# EAGLE schematic logic_vB (EAGLE 6.4)

## Sheet 1 of 4: Power
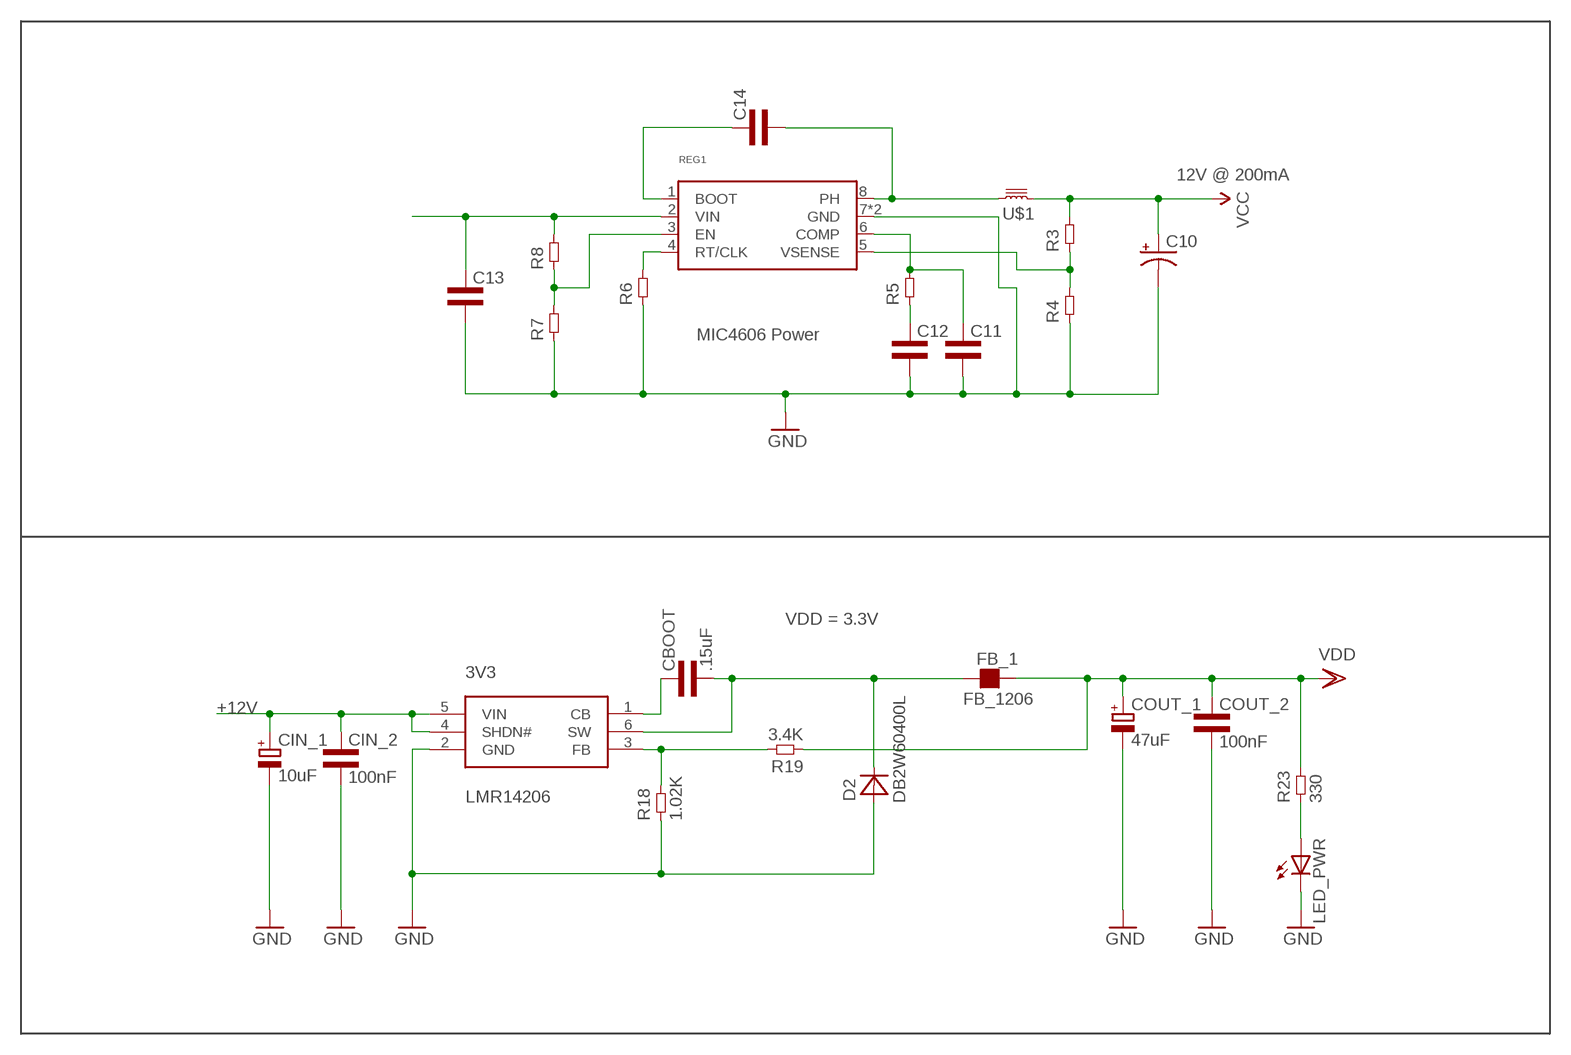
[diagram p0: schematic, sheet 1]

### Parts
3V3  LMR14206  [R-PDSO-G6]
C10  CPOL-US153CLV-0605  [153CLV-0605]
C11  CAP0603L3  [0603L3]
C12  CAP0603L3  [0603L3]
C13  CAP0805L3  [0805L3]
C14  CAP0603L3  [0603L3]
CBOOT  .15uF  CAP0603L3  [0603L3]
CIN_1  10uF  CPOL-EUB/3528-21W  [B/3528-21W]
CIN_2  100nF  CAP0603L3  [0603L3]
COUT_1  47uF  CPOL-EUB/3528-21W  [B/3528-21W]
COUT_2  100nF  CAP0603L3  [0603L3]
D2  DB2W60400L  [SC-109B]
FB_1  FB_1206  [L1206]
LED_PWR  LEDCHIP-LED0603  [CHIP-LED0603]
R3  RES0603L3  [0603L3]
R4  RES0603L3  [0603L3]
R5  RES0603L3  [0603L3]
R6  RES0603L3  [0603L3]
R7  RES0603L3  [0603L3]
R8  RES0603L3  [0603L3]
R18  1.02K  RES0402L3  [0402L3]
R19  3.4K  RES0402L3  [0402L3]
R23  330  RES0402L3  [0402L3]
REG1  TPS54061  [S-PVSON-N8]
U$1  SDR0604  [SDR0604]

### Nets
3V3: 3V3.6(SW) CBOOT.P$2 D2.1(C) FB_1.1
+12V: 3V3.4(SHDN#) 3V3.5(VIN) C13.1 CIN_1.+ CIN_2.P$1 R8.P$2 REG1.2(VIN) ; also sheet 4
BOOT: C14.P$1 REG1.1(BOOT)
COMP: C11.P$1 R5.P$2 REG1.6(COMP)
EN: R7.P$2 R8.P$1 REG1.3(EN)
GND: 3V3.2(GND) C10.- C11.P$2 C12.P$2 C13.2 CIN_1.- CIN_2.P$2 COUT_1.- COUT_2.P$2 D2.2(A) LED_PWR.C R4.P$1 R6.P$1 R7.P$1 R18.P$1 REG1.7(GND) REG1.P$1(GND) ; also sheet 2,3,4
N$9: 3V3.1(CB) CBOOT.P$1
N$20: 3V3.3(FB) R18.P$2 R19.P$2
N$33: C12.P$1 R5.P$1
N$39: LED_PWR.A R23.P$1
PH: C14.P$2 REG1.8(PH) U$1.2
RT: R6.P$2 REG1.4(RT/CLK)
VCC: C10.+ R3.P$2 U$1.1 ; also sheet 2
VDD: COUT_1.+ COUT_2.P$1 FB_1.2 R19.P$1 R23.P$2 ; also sheet 2,3
VSENSE: R3.P$1 R4.P$2 REG1.5(VSENSE)

### Notes on the sheet
- 12V @ 200mA
- MIC4606 Power
- VDD = 3.3V

## Sheet 2 of 4: MCU
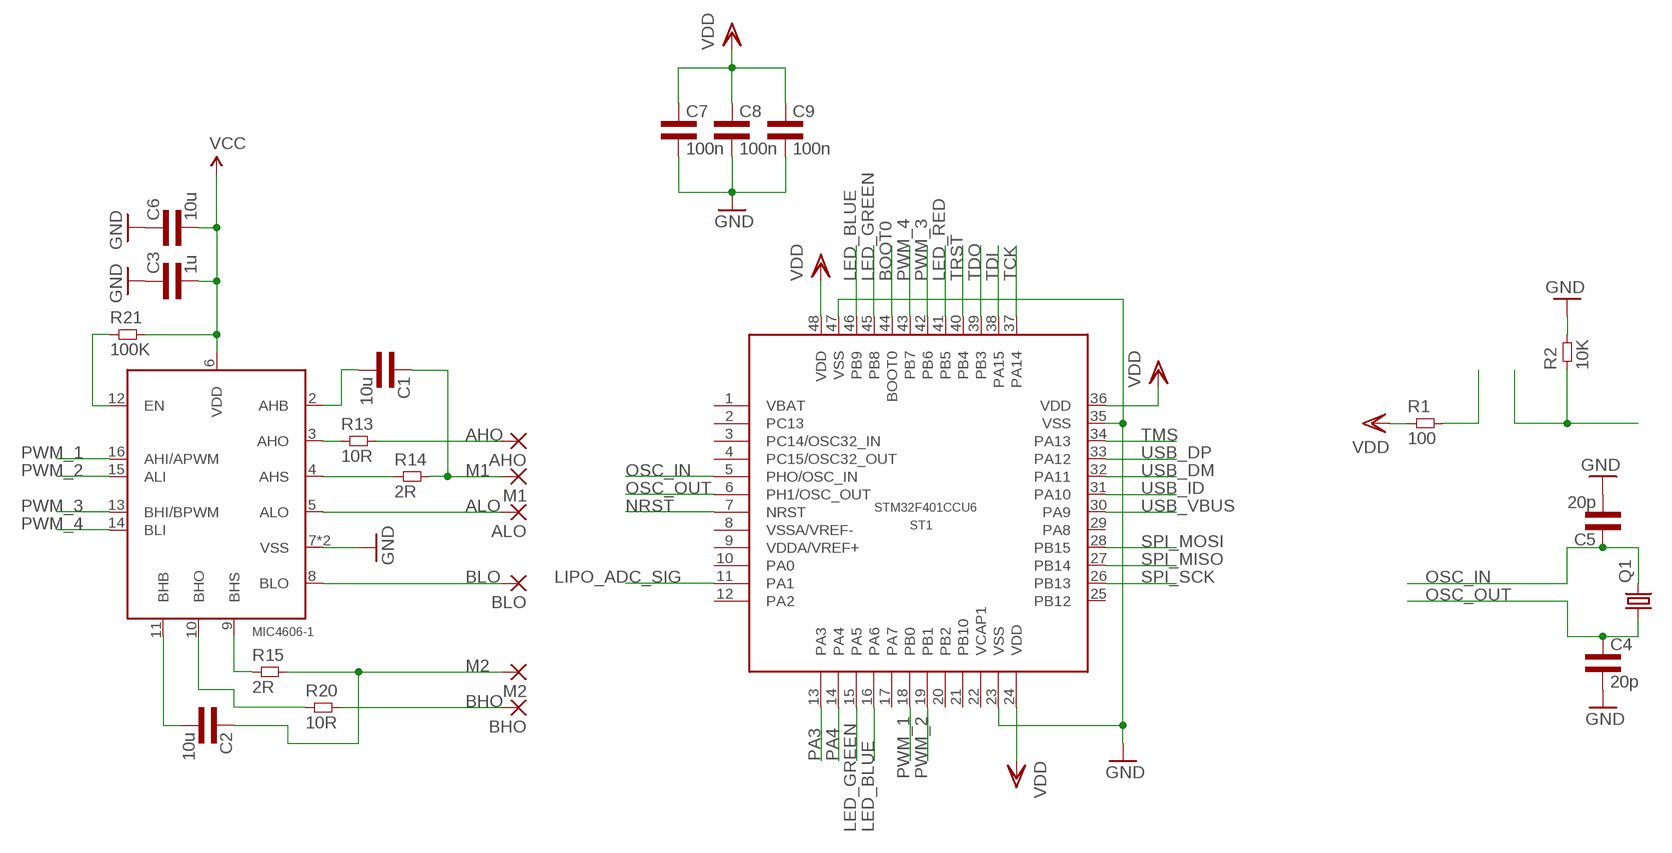
[diagram p1: schematic, sheet 2]

### Parts
AHO  2,54/1,1  [2,54/1,1]
ALO  2,54/1,1  [2,54/1,1]
BHO  2,54/1,1  [2,54/1,1]
BLO  2,54/1,1  [2,54/1,1]
C1  10u  CAP0805L3  [0805L3]
C2  10u  CAP0805L3  [0805L3]
C3  1u  CAP0603L3  [0603L3]
C4  20p  CAP0402L3  [0402L3]
C5  20p  CAP0402L3  [0402L3]
C6  10u  CAP0603L3  [0603L3]
C7  100n  CAP0402L3  [0402L3]
C8  100n  CAP0402L3  [0402L3]
C9  100n  CAP0402L3  [0402L3]
M1  2,54/1,1  [2,54/1,1]
M2  2,54/1,1  [2,54/1,1]
MD1  MIC4606-1  [QFN44-16LD-PL-2]
Q1  CRYSTALCTS406  [CTS406]
R1  100  RES0402L3  [0402L3]
R2  10K  RES0402L3  [0402L3]
R13  10R  RES0805L3  [0805L3]
R14  2R  RES0805L3  [0805L3]
R15  2R  RES0805L3  [0805L3]
R20  10R  RES0805L3  [0805L3]
R21  100K  RES0603L3  [0603L3]
ST1  STM32F401CCU6  [UFQFPN48]

### Nets
AHO: AHO.1(P) R13.2
ALO: ALO.1(P) MD1.5(ALO)
BHO: BHO.1(P) R20.2
BLO: BLO.1(P) MD1.8(BLO)
BOOT0: ST1.44(BOOT0)
GND: C3.P$1 C4.P$2 C5.P$2 C6.P$1 C7.P$2 C8.P$2 C9.P$2 MD1.7(VSS) MD1.TP(VSS) R2.P$2 ST1.23(VSS) ST1.35(VSS) ST1.47(VSS) ; also sheet 1,3,4
LED_BLUE: ST1.16(PA6) ST1.46(PB9) ; also sheet 3
LED_GREEN: ST1.15(PA5) ST1.45(PB8) ; also sheet 3
LED_RED: ST1.41(PB5) ; also sheet 3
LIPO_ADC_SIG: ST1.11(PA1) ; also sheet 4
M1: C1.1 M1.1(P) R14.2
M2: C2.1 M2.1(P) R15.2
N$3: C1.2 MD1.2(AHB)
N$4: C2.2 MD1.11(BHB)
N$7: MD1.3(AHO) R13.1
N$14: MD1.4(AHS) R14.1
N$15: MD1.9(BHS) R15.1
N$17: MD1.10(BHO) R20.1
N$42: MD1.12(EN) R21.P$1
NRST: ST1.7(NRST)
OSC_IN: C5.P$1 Q1.3 ST1.5(PHO/OSC_IN)
OSC_OUT: C4.P$1 Q1.1 ST1.6(PH1/OSC_OUT)
PA3: ST1.13(PA3)
PA4: ST1.14(PA4)
PWM_1: MD1.16(AHI/APWM) ST1.18(PB0)
PWM_2: MD1.15(ALI) ST1.19(PB1)
PWM_3: MD1.13(BHI/BPWM) ST1.42(PB6)
PWM_4: MD1.14(BLI) ST1.43(PB7)
RST_BTN: R2.P$1
RST_BTN_VDD: R1.P$2
SPI_MISO: ST1.27(PB14)
SPI_MOSI: ST1.28(PB15)
SPI_SCK: ST1.26(PB13)
TCK: ST1.37(PA14)
TDI: ST1.38(PA15)
TDO: ST1.39(PB3)
TMS: ST1.34(PA13)
TRST: ST1.40(PB4)
USB_DM: ST1.32(PA11)
USB_DP: ST1.33(PA12)
USB_ID: ST1.31(PA10)
USB_VBUS: ST1.30(PA9)
VCC: C3.P$2 C6.P$2 MD1.6(VDD) R21.P$2 ; also sheet 1
VDD: C7.P$1 C8.P$1 C9.P$1 R1.P$1 ST1.24(VDD) ST1.36(VDD) ST1.48(VDD) ; also sheet 1,3
Unconnected: ST1.1(VBAT) ST1.2(PC13) ST1.3(PC14/OSC32_IN) ST1.4(PC15/OSC32_OUT) ST1.8(VSSA/VREF-) ST1.9(VDDA/VREF+) ST1.10(PA0) ST1.12(PA2) ST1.17(PA7) ST1.20(PB2) ST1.21(PB10) ST1.22(VCAP1) ST1.25(PB12) ST1.29(PA8)

## Sheet 3 of 4: LED
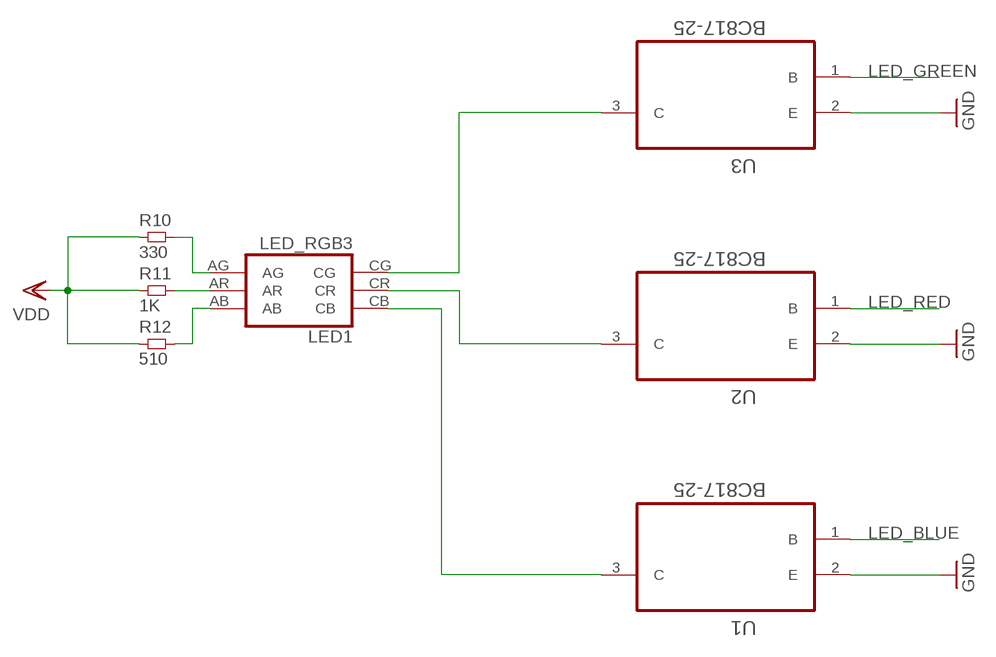
[diagram p2: schematic, sheet 3]

### Parts
LED1  LED_RGB3  [RGBLED]
R10  330  RES0402L3  [0402L3]
R11  1K  RES0402L3  [0402L3]
R12  510  RES0402L3  [0402L3]
U1  BC817-25  [SOT95P240X97-3N]
U2  BC817-25  [SOT95P240X97-3N]
U3  BC817-25  [SOT95P240X97-3N]

### Nets
AB: LED1.AB R12.P$2
AG: LED1.AG R10.P$2
AR: LED1.AR R11.P$2
GND: U1.2(E) U2.2(E) U3.2(E) ; also sheet 1,2,4
LED_BLUE: U1.1(B) ; also sheet 2
LED_GREEN: U3.1(B) ; also sheet 2
LED_RED: U2.1(B) ; also sheet 2
N$25: LED1.CG U3.3(C)
N$28: LED1.CR U2.3(C)
N$29: LED1.CB U1.3(C)
VDD: R10.P$1 R11.P$1 R12.P$1 ; also sheet 1,2

## Sheet 4 of 4: LiPo V Div
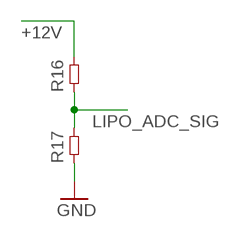
[diagram p3: schematic, sheet 4]

### Parts
R16  RES0805L3  [0805L3]
R17  RES0805L3  [0805L3]

### Nets
+12V: R16.2 ; also sheet 1
GND: R17.1 ; also sheet 1,2,3
LIPO_ADC_SIG: R16.1 R17.2 ; also sheet 2

## Library data of the parts
3V3 = ti_lmr14206:LMR14206
AHO ALO BHO BLO M1 M2 = wirepad:2,54/1,1: THROUGH-HOLE PAD
C1-C9 C11-C14 CBOOT CIN_2 COUT_2 = common:CAP
C10 = rcl:CPOL-US: POLARIZED CAPACITOR, American symbol
CIN_1 COUT_1 = rcl:CPOL-EU: POLARIZED CAPACITOR, European symbol
D2 = diode-1:DB2W60400L
FB_1 = rc-master-smd:FB_: FERRITE BEAD
LED1 = dp_devices:LED_RGB3
LED_PWR = adafruit:LED: LED OSRAM: - CHIPLED LG R971, LG N971, LY N971, LG Q971, LY Q971, LO R971, LY R971 LH N974, LH R974 LS Q976, LO Q976, LY Q976 LO Q996 - Hyper CHIPLED LW Q18S LB Q993, LB Q99A, LB R99A - SideLED LS A670, LO A670, LY A670, LG A670, LP A670 LB A673, LV A673, LT A673, LW A673 LH A674 LY A675 LS A676, LA A676, LO A676, LY A676, LW A676 LS A679, LY A679, LG A679 - Hyper Micro SIDELED® LS Y876, LA Y876, LO Y876, LY Y876 LT Y87S - SmartLED LW L88C, LW L88S LB L89C, LB L89S, LG L890 LS L89K, LO L89K, LY L89K LS L896, LA L896, LO L896, LY L896 - TOPLED LS T670, LO T670, LY T670, LG T670, LP T670 LSG T670, LSP T670, LSY T670, LOP T670, LYG T670 LG T671, LOG T671, LSG T671 LB T673, LV T673, LT T673, LW T673 LH T674 LS T676, LA T676, LO T676, LY T676, LB T676, LH T676, LSB T676, LW T676 LB T67C, LV T67C, LT T67C, LS T67K, LO T67K, LY T67K, LW E67C LS E67B, LA E67B, LO E67B, LY E67B, LB E67C, LV E67C, LT E67C LW T67C LS T679, LY T679, LG T679 LS T770, LO T770, LY T770, LG T770, LP T770 LB T773, LV T773, LT T773, LW T773 LH T774 LS E675, LA E675, LY E675, LS T675 LS T776, LA T776, LO T776, LY T776, LB T776 LHGB T686 LT T68C, LB T68C - Hyper Mini TOPLED® LB M676 - Mini TOPLED Santana® LG M470 LS M47K, LO M47K, LY M47K Source: http://www.osram.convergy.de/
MD1 = common:MIC4606: 85V Full-Bridge Mosfet Driver
Q1 = crystal:CRYSTAL: CRYSTAL; OC_FARNELL: unknown; OC_NEWARK: unknown
R1-R8 R10-R21 R23 = common:RES
REG1 = common:TPS54061: Switching Reg - 60V Input / 200mA Output
ST1 = common:STM32F401CCU6
U1-U3 = Fairchild_By_element14_Batch_1:BC817-25: NPN Epitaxial Silicon Transistor; MPN: BC817-25; OC_FARNELL: 1228216; OC_NEWARK: -; PACKAGE: SOT-3; SUPPLIER: Fairchild
U$1 = common:SDR0604